# Altium schematic sheet Power&CH340T.SchDoc
size A4
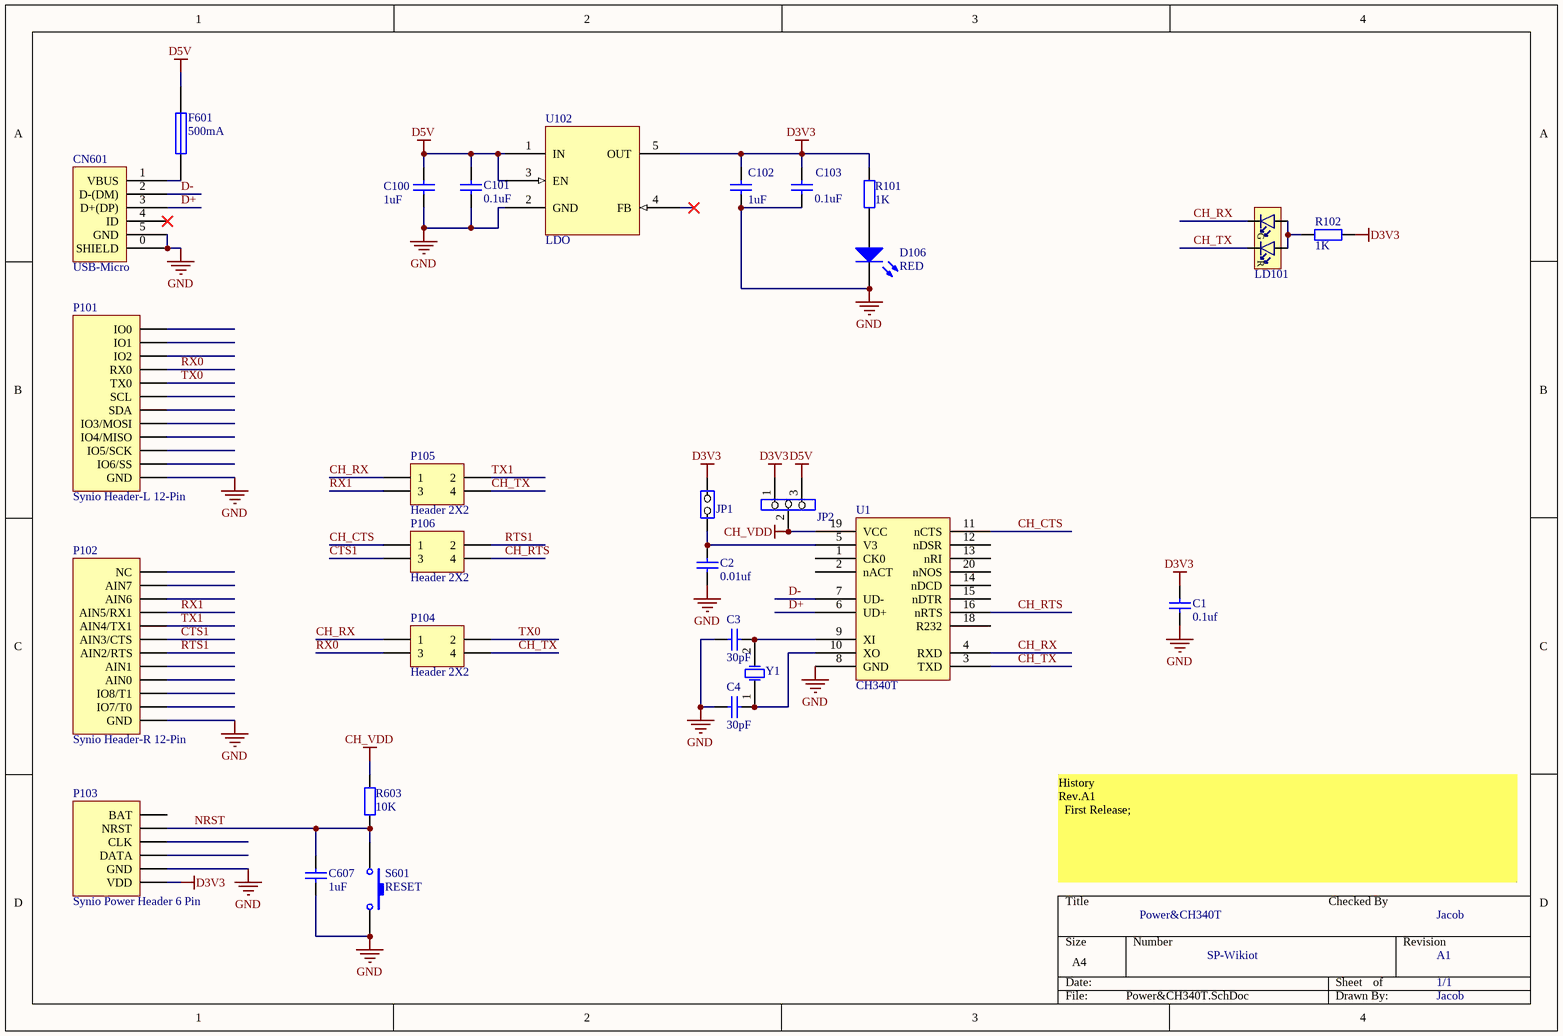
[diagram p0: Power&CH340T.SchDoc]

## Parts
C1  value 0.1uf  [C0603L]  (hidden comment: Cap)
C2  value 0.01uf  [C0603L]  (hidden comment: Cap)
C3  value 30pF  [C0603L]  (hidden comment: Cap)
C4  value 30pF  [C0603L]  (hidden comment: Cap)
C100  1uF  [0603M]
C101  0.1uF  [0603M]
C102  1uF  [0603M]
C103  0.1uF  [0603M]
C607  1uF  [C0603L]
CN601  USB-Micro  [USB-MICRO-Female-Lite]
D106  RED  [0603pn]
F601  500mA  [0805]
JP1  Jumper2-2  [SIP2]  (value not drawn)
JP2  Jumper3  [SIP3]  (value not drawn)
LD101  LTST-C195KGJRKT  [0805-LED-Bi]  (value not drawn)
P101  Synio Header-L 12-Pin  [HDR1X12]
P102  Synio Header-R 12-Pin  [HDR1X12]
P103  Synio Power Header 6 Pin  [HDR1X6/2.54MM]
P104  Header 2X2  [HDR2X2/2.54MM]
P105  Header 2X2  [HDR2X2/2.54MM]
P106  Header 2X2  [HDR2X2/2.54MM]
R101  1K  [0603M]
R102  1K  [0603M]
R603  10K  [0603M]
S601  RESET  [KEY-2x4-SMD]
U1  CH340T  [SSOP20]
U102  LDO  [SOT23-5]
Y1  XTAL  [XTAL_49S]  (value not drawn)

## Nets
CH_VDD: JP2.2 R603.1 U1.19(VCC)
D3V3: C1.2 C102.2 C103.2 JP1.2(NO) JP2.1 P103.1(VDD) R101.2 R102.1 U102.5(OUT)
D5V: C100.2 C101.2 F601.1 JP2.3 U102.1(IN) U102.3(EN)
GND: C1.1 C2.2 C3.2 C4.2 C100.1 C101.1 C102.1 C103.1 C607.1 CN601.0(SHIELD) CN601.5(GND) D106.2(K) P101.1(GND) P102.1(GND) P103.2(GND) S601.1 U1.8(GND) U102.2(GND)
CH_CTS: P106.1 U1.11(nCTS)
CH_RTS: P106.4 U1.16(nRTS)
CH_RX: LD101.1(C1) P104.1 P105.1 U1.4(RXD)
CH_TX: LD101.2(C2) P104.4 P105.4 U1.3(TXD)
CTS1: P102.7(AIN3/CTS) P106.3
D+: CN601.3(D+(DP)) U1.6(UD+)
D-: CN601.2(D-(DM)) U1.7(UD-)
NRST: C607.2 P103.5(NRST) R603.2 S601.2
RTS1: P102.6(AIN2/RTS) P106.2
RX0: P101.9(RX0) P104.3
RX1: P102.9(AIN5/RX1) P105.3
TX0: P101.8(TX0) P104.2
TX1: P102.8(AIN4/TX1) P105.2
NetC2_1: C2.1 JP1.1(COMMON) U1.5(V3)
NetC3_1: C3.1 U1.9(XI) Y1.2(OSC2)
NetC4_1: C4.1 U1.10(XO) Y1.1(OSC1)
NetCN601_1: CN601.1(VBUS) F601.2
NetD106_1: D106.1(A) R101.1
NetLD101_3: LD101.3(A2) LD101.4(A1) R102.2

Not connected (* = marked no-connect by the designer): CN601 4(ID)*; P101 2(IO6/SS) 3(IO5/SCK) 4(IO4/MISO) 5(IO3/MOSI) 6(SDA) 7(SCL) 10(IO2) 11(IO1) 12(IO0); P102 2(IO7/T0) 3(IO8/T1) 4(AIN0) 5(AIN1) 10(AIN6) 11(AIN7) 12(NC); P103 3(DATA) 4(CLK) 6(BAT); U1 1(CK0) 2(nACT) 12(nDSR) 13(nRI) 14(nDCD) 15(nDTR) 18(R232) 20(nNOS); U102 4(FB)*

## Notes on the sheet
- History
  Rev.A1
  First Release;
- Power&CH340T
- Checked By
- Jacob
- SP-Wikiot
- A1
- 1/1
- (in symbol LED-DUAL) G; R

## Library data of the parts
C1-C4 C100-C103 C607 = Cap: Capacitor; Published: 8-Jun-2000; LatestRevisionDate: 17-Jul-2002; LatestRevisionNote: Re-released for DXP Platform.
  C1-C4: Publisher: Altium Limited
  C100 C102: PackageReference: RAD-0.3; Value: 1uF
  C101 C103: PackageReference: RAD-0.3; Value: 0.1uF
  C607: PackageReference: RAD-0.3; Publisher: Altium Limited; Value: 1uF
D106 = LED0: Typical INFRARED GaAs LED; Published: 8-Jun-2000; LatestRevisionDate: 08-Jul-2005; LatestRevisionNote: Mech Layer 1 removed.; PackageReference: LED-0; Publisher: Altium Limited
F601 = Fuse 1: Fuse; Published: 8-Jun-2000; LatestRevisionDate: 17-Jul-2002; LatestRevisionNote: Re-released for DXP Platform.; PackageReference: PIN-W2/E2.8; Publisher: Altium Limited; PackageDescription: Thru-Hole; 2 Leads
JP1 = Jumper2-2: Jumper2
LD101 = LED-DUAL: Avago, HSMF-A203 Bi-Color LED; Manufacturer: Lite-On Inc; 2nd source part number: 859-LTST-C195KGJRKT; Note: HSMF-A203- xxxxx GaP Red GaP Emerald Green; Artikkelnr Noca: 13019145; Part Number: LTST-C195KGJRKT; Manufacturer Part Number: LTST-C195KGJRKT; Datasheet: http://media.digikey.com/pdf/Data%20Sheets/Lite-On%20PDFs/LTST-C195KGJRKT.pdf; Footprint: LED_DUAL_0606; LatestRevisionDate: 2012-07-05; Pin Count: 4; Publisher: Nordic Semiconductor; Published: 2012-07-05; Value: LTST-C195KGJRKT; Supplier: Digi-Key; Supplier part number: 160-1452-1-ND; 2nd source Supplier: Mouser
P101 = Synio Header-L 12-Pin: Synio Header-L, 12-Pin; LatestRevisionDate: 17-Jul-2002; LatestRevisionNote: Re-released for DXP Platform.; Publisher: Altium Limited
P102 = Synio Header-R 12-Pin: Synio Header-R, 12-Pin; LatestRevisionDate: 17-Jul-2002; LatestRevisionNote: Re-released for DXP Platform.; Publisher: Altium Limited
P104-P106 = Header 2X2: Header, 2-Pin, Dual row; LatestRevisionDate: 17-Jul-2002; LatestRevisionNote: Re-released for DXP Platform.; Publisher: Altium Limited
R101 R102 R603 = Res2: Resistor; Published: 8-Jun-2000; LatestRevisionDate: 17-Jul-2002; LatestRevisionNote: Re-released for DXP Platform.; PackageReference: AXIAL-0.4; Publisher: Altium Limited
  R101 R102: Value: 1K
  R603: Value: 10K
S601 = SW-PB: Switch; Published: 24-Mar-1999; LatestRevisionDate: 17-Jul-2002; LatestRevisionNote: Re-released for DXP Platform.; PackageReference: SPST-2; Publisher: Altium Limited
U102 = LDO-SOT23-5: General LDO SOT23-5
Y1 = XTAL: Crystal Oscillator; Published: 8-Jun-2000; LatestRevisionDate: 17-Jul-2002; LatestRevisionNote: Re-released for DXP Platform.; PackageReference: R38; Publisher: Altium Limited